# EAGLE design Esquematico (EAGLE 5.11)
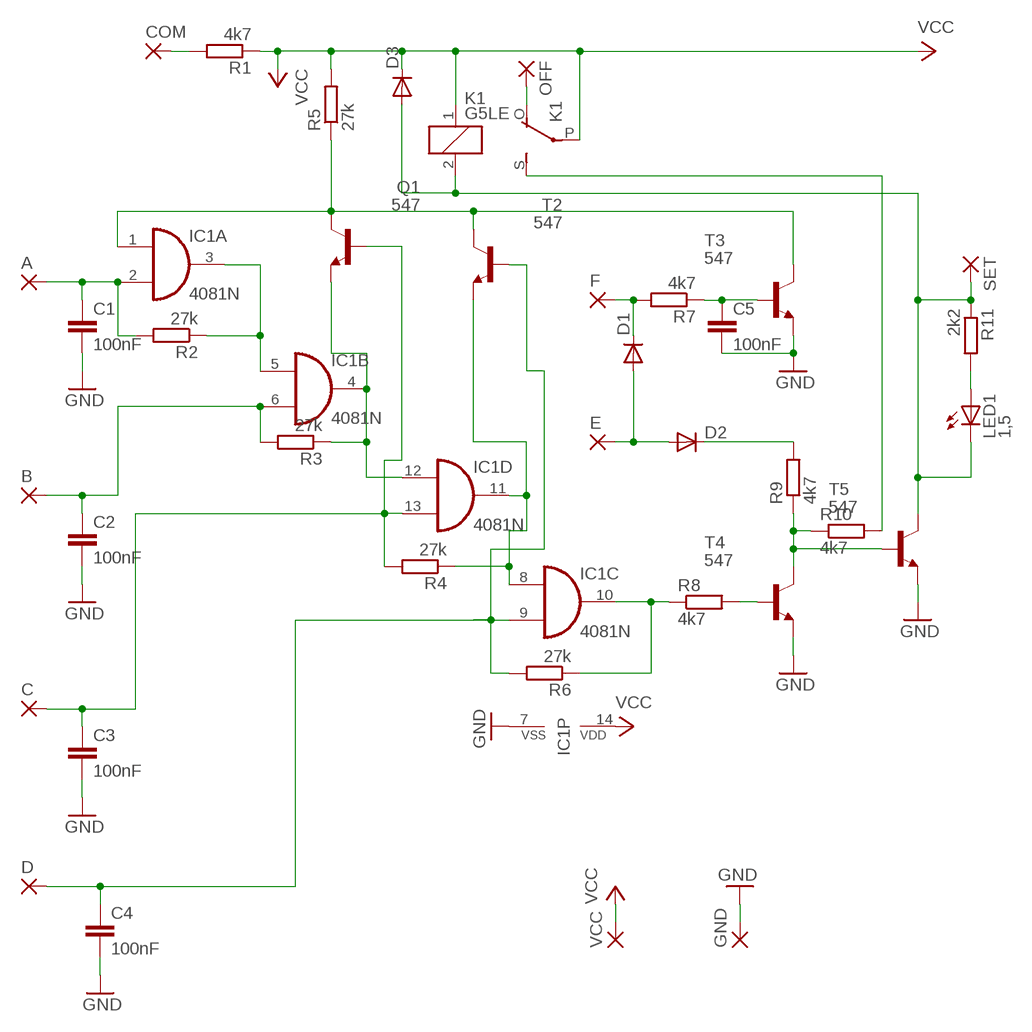
[diagram p0: schematic, sheet 1]

## Parts
A  WIREPAD2,15/1,0  [2,15/1,0]
B  WIREPAD2,15/1,0  [2,15/1,0]
C  WIREPAD2,15/1,0  [2,15/1,0]
C1  100nF  C2,5-3  [C2.5-3]
C2  100nF  C2,5-3  [C2.5-3]
C3  100nF  C2,5-3  [C2.5-3]
C4  100nF  C2,5-3  [C2.5-3]
C5  100nF  C2,5-3  [C2.5-3]
COM  WIREPAD2,15/1,0  [2,15/1,0]
D  WIREPAD2,15/1,0  [2,15/1,0]
D1  1N4148DO35-7  [DO35-7]
D2  1N4148DO35-7  [DO35-7]
D3  1N4148DO35-7  [DO35-7]
E  WIREPAD2,15/1,0  [2,15/1,0]
F  WIREPAD2,15/1,0  [2,15/1,0]
GND  WIREPAD2,15/1,0  [2,15/1,0]
IC1  4081N  [DIL14]
K1  G5LE  [G5LE]
LED1  1,5  LED5MM  [LED5MM]
OFF  WIREPAD2,15/1,0  [2,15/1,0]
Q1  547  BC547-NPN-TO92-CBE  [TO92-CBE]
R1  4k7  R-EU_0204/7  [0204/7]
R2  27k  R-EU_0204/7  [0204/7]
R3  27k  R-EU_0204/7  [0204/7]
R4  27k  R-EU_0204/7  [0204/7]
R5  27k  R-EU_0204/7  [0204/7]
R6  27k  R-EU_0204/7  [0204/7]
R7  4k7  R-EU_0204/7  [0204/7]
R8  4k7  R-EU_0204/7  [0204/7]
R9  4k7  R-EU_0204/7  [0204/7]
R10  4k7  R-EU_0204/7  [0204/7]
R11  2k2  R-EU_0204/7  [0204/7]
SET  WIREPAD2,15/1,0  [2,15/1,0]
T2  547  BC547-NPN-TO92-CBE  [TO92-CBE]
T3  547  BC547-NPN-TO92-CBE  [TO92-CBE]
T4  547  BC547-NPN-TO92-CBE  [TO92-CBE]
T5  547  BC547-NPN-TO92-CBE  [TO92-CBE]
VCC  WIREPAD2,15/1,0  [2,15/1,0]

## Nets
GND: C1.2 C2.2 C3.2 C4.2 C5.2 GND.1(P) IC1.7(P:VSS) T3.E T4.E T5.E
N$1: COM.1(P) R1.2
N$2: K1.O(2:O) OFF.1(P)
N$3: A.1(P) C1.1 IC1.2(A:I1) R2.2
N$4: IC1.1(A:I0) Q1.C R5.1 T2.C T3.C
N$5: D3.A K1.2 LED1.K(C) R11.1 SET.1(P) T5.C
N$6: IC1.3(A:O) IC1.5(B:I0) R2.1
N$7: IC1.4(B:O) IC1.12(D:I0) Q1.E R3.1
N$8: C3.1 C.1(P) IC1.13(D:I1) Q1.B R4.2
N$9: IC1.8(C:I0) IC1.11(D:O) R4.1 T2.E
N$10: B.1(P) C2.1 IC1.6(B:I1) R3.2
N$11: C4.1 D.1(P) IC1.9(C:I1) R6.2 T2.B
N$12: C5.1 R7.1 T3.B
N$13: D1.C F.1(P) R7.2
N$14: D1.A D2.A E.1(P)
N$15: D2.C R9.2
N$16: R9.1 R10.1 T4.C T5.B
N$17: R8.2 T4.B
N$18: IC1.10(C:O) R6.1 R8.1
N$19: K1.S(2:S) R10.2
N$22: LED1.A R11.2
VCC: D3.C IC1.14(P:VDD) K1.1 K1.P(2:P) R1.1 R5.2 VCC.1(P)

## Library data of the parts
A B C COM D E F GND OFF SET VCC = wirepad:WIREPAD: Wire PAD connect wire on PCB
C1-C5 = capacitor-wima:C: CAPACITOR naming: grid - package width
D1-D3 = diode:1N4148: DIODE high speed (Philips)
IC1 = 40xx:4081: Quad 2-input AND
K1 = relay:G5LE: RELAY 1 x switch, 10 A/120 V AC, 8 A/30 V DC, Omron; OC_FARNELL: unknown; OC_NEWARK: unknown
LED1 = led:LED: LED OSRAM: - CHIPLED LG R971, LG N971, LY N971, LG Q971, LY Q971, LO R971, LY R971 LH N974, LH R974 LS Q976, LO Q976, LY Q976 LO Q996 - Hyper CHIPLED LW Q18S LB Q993, LB Q99A, LB R99A - SideLED LS A670, LO A670, LY A670, LG A670, LP A670 LB A673, LV A673, LT A673, LW A673 LH A674 LY A675 LS A676, LA A676, LO A676, LY A676, LW A676 LS A679, LY A679, LG A679 - Hyper Micro SIDELED® LS Y876, LA Y876, LO Y876, LY Y876 LT Y87S - SmartLED LW L88C, LW L88S LB L89C, LB L89S, LG L890 LS L89K, LO L89K, LY L89K LS L896, LA L896, LO L896, LY L896 - TOPLED LS T670, LO T670, LY T670, LG T670, LP T670 LSG T670, LSP T670, LSY T670, LOP T670, LYG T670 LG T671, LOG T671, LSG T671 LB T673, LV T673, LT T673, LW T673 LH T674 LS T676, LA T676, LO T676, LY T676, LB T676, LH T676, LSB T676, LW T676 LB T67C, LV T67C, LT T67C, LS T67K, LO T67K, LY T67K, LW E67C LS E67B, LA E67B, LO E67B, LY E67B, LB E67C, LV E67C, LT E67C LW T67C LS T679, LY T679, LG T679 LS T770, LO T770, LY T770, LG T770, LP T770 LB T773, LV T773, LT T773, LW T773 LH T774 LS E675, LA E675, LY E675, LS T675 LS T776, LA T776, LO T776, LY T776, LB T776 LHGB T686 LT T68C, LB T68C - Hyper Mini TOPLED® LB M676 - Mini TOPLED Santana® LG M470 LS M47K, LO M47K, LY M47K Source: http://www.osram.convergy.de LUXEON: - LUMILED® LXK2-PW12-R00, LXK2-PW12-S00, LXK2-PW14-U00, LXK2-PW14-V00 LXK2-PM12-R00, LXK2-PM12-S00, LXK2-PM14-U00 LXK2-PE12-Q00, LXK2-PE12-R00, LXK2-PE12-S00, LXK2-PE14-T00, LXK2-PE14-U00 LXK2-PB12-K00, LXK2-PB12-L00, LXK2-PB12-M00, LXK2-PB14-N00, LXK2-PB14-P00, LXK2-PB14-Q00 LXK2-PR12-L00, LXK2-PR12-M00, LXK2-PR14-Q00, LXK2-PR14-R00 LXK2-PD12-Q00, LXK2-PD12-R00, LXK2-PD12-S00 LXK2-PH12-R00, LXK2-PH12-S00 LXK2-PL12-P00, LXK2-PL12-Q00, LXK2-PL12-R00 Source: www.luxeon.com KINGBRIGHT: KA-3528ASYC Source: www.kingbright.com
Q1 T2-T5 = transistor:*-NPN-: NPN Transistror BF959 corrected 2008.03.06
R1-R11 = rcl:R-EU_: RESISTOR, European symbol

## Board
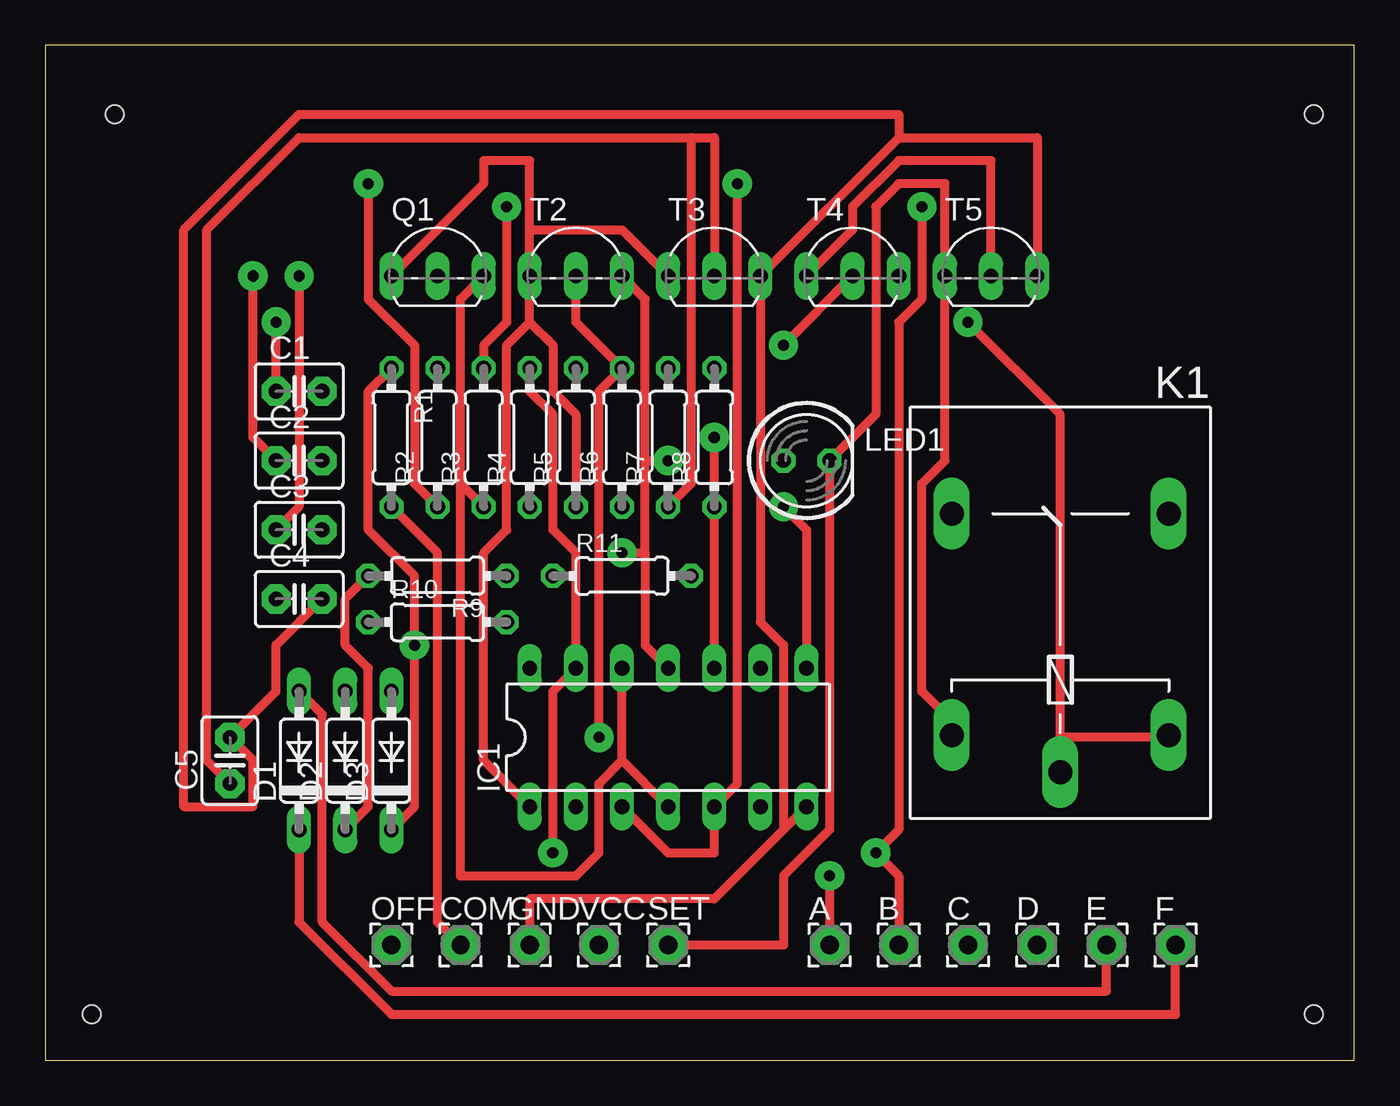
[diagram p1: board, top side]
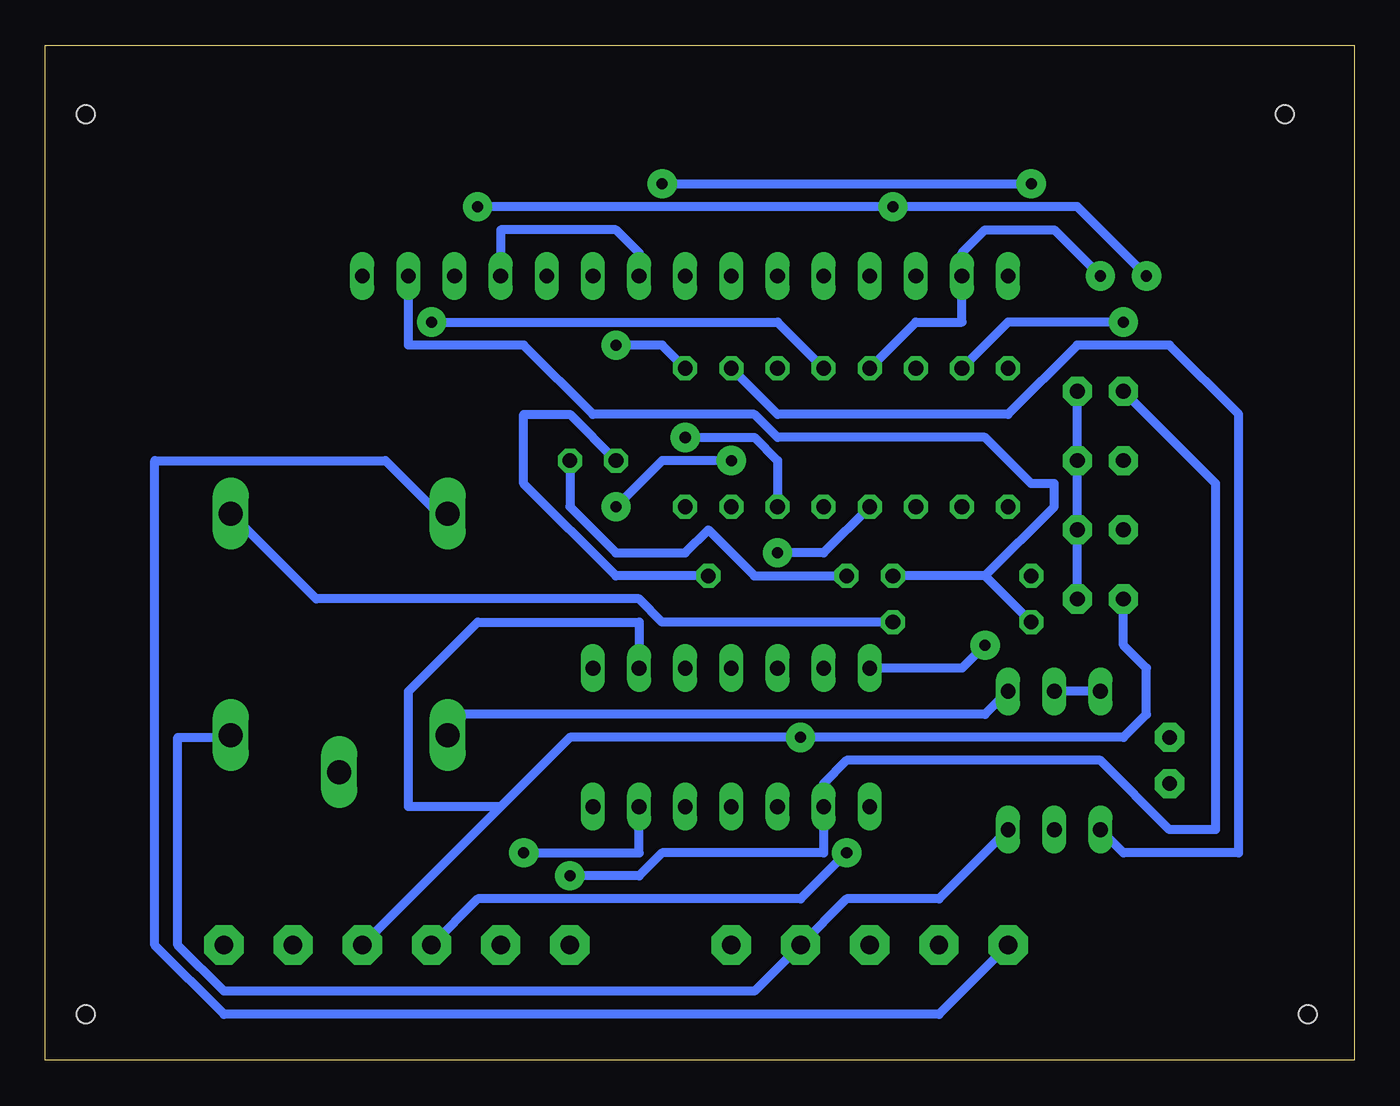
[diagram p2: board, bottom side, seen from below]

Size 72.06 x 55.87 mm. Coordinates in mm from the lower left corner, seen from the top.
Outline: 0,0 72.06,0 72.06,55.87 0,55.87 0,0
Copper layers (1*16): Top 0.035mm / dielectric 1.5mm / Bottom 0.035mm
Design rules "default *": minimum track width 20mil, minimum drill 24mil, track to track 8mil, track to pad 8mil, pad to pad 8mil, via to via 8mil, smd to smd 8mil, copper to edge 40mil, drill to drill 8mil, minimum pad ring 10mil, minimum via ring 0.5mm, stop-mask expansion 4mil, vias tented up to drill 0mil, thermal gap 10mil
Holes 1 mm at 3.81,52.07 2.54,2.54 69.85,52.07 69.85,2.54

### Footprints (pad centres in the part's own frame; a part is rotated, then mirrored left to right if it is on the bottom)
2,15/1,0 = drill 1.016 pad 2.159 octagon: 1 0,0
C2.5-3 = drill 0.813 pad 1.6 octagon: 1 -1.27,0; 2 1.27,0
DO35-7 = drill 0.813 long: A 3.81,0; C -3.81,0
DIL14 = drill 0.813 long: 1 -7.62,-3.81; 2 -5.08,-3.81; 3 -2.54,-3.81; 4 0,-3.81; 5 2.54,-3.81; 6 5.08,-3.81; 7 7.62,-3.81; 8 7.62,3.81; 9 5.08,3.81; 10 2.54,3.81; 11 0,3.81; 12 -2.54,3.81; 13 -5.08,3.81; 14 -7.62,3.81
G5LE = drill 1.321 long: 1 -7.493,-5.969; 2 -7.493,5.969; O 4.699,5.969; P -9.525,0; S 4.699,-5.969
LED5MM = drill 0.813 octagon: A -1.27,0; K 1.27,0
TO92-CBE = drill 0.813 long: B 0,0; C -2.54,0; E 2.54,0
0204/7 = drill 0.813 octagon: 1 -3.81,0; 2 3.81,0

### Placement (x,y rotation side)
A  43.18,6.35 0 top
B  46.99,6.35 0 top
C  50.8,6.35 0 top
C1  13.97,36.83 0 top
C2  13.97,33.02 0 top
C3  13.97,29.21 0 top
C4  13.97,25.4 0 top
C5  10.16,16.51 90 top
COM  22.86,6.35 0 top
D  54.61,6.35 0 top
D1  13.97,16.51 90 top
D2  16.51,16.51 90 top
D3  19.05,16.51 90 top
E  58.42,6.35 0 top
F  62.23,6.35 0 top
GND  26.67,6.35 0 top
IC1  34.29,17.78 0 top
K1  55.88,25.4 90 top
LED1  41.91,33.02 0 top
OFF  19.05,6.35 0 top
Q1  21.59,43.18 0 top
R1  19.05,34.29 270 top
R2  21.59,34.29 90 top
R3  24.13,34.29 90 top
R4  26.67,34.29 90 top
R5  29.21,34.29 90 top
R6  31.75,34.29 90 top
R7  34.29,34.29 90 top
R8  36.83,34.29 90 top
R9  21.59,26.67 180 top
R10  21.59,24.13 0 top
R11  31.75,26.67 0 top
SET  34.29,6.35 0 top
T2  29.21,43.18 0 top
T3  36.83,43.18 0 top
T4  44.45,43.18 0 top
T5  52.07,43.18 0 top
VCC  30.48,6.35 0 top

### Tracks (layer width: path | path; a pad name or v marks a point on that pad's centre or on a via)
GND
  Top 0.508: C4.2 12.7,22.86 12.7,20.32 C5.2 11.43,16.51 11.43,13.97 7.62,13.97 7.62,45.72 13.97,52.07 46.99,52.07 46.99,50.8 | 46.99,50.8 T3.E 39.37,24.13 40.64,22.86 40.64,12.7 | 46.99,50.8 54.61,50.8 T5.E | 40.64,12.7 36.83,8.89 26.67,8.89 GND.1 | 40.64,12.7 IC1.7
  Bottom 0.508: C1.2 C2.2 C3.2 C4.2 | T4.E 46.99,45.72 40.64,45.72 39.37,44.45 T3.E
N$1
  Top 0.508: R1.2 21.59,27.94 21.59,7.62 COM.1
N$2
  Bottom 0.508: OFF.1 22.86,2.54 62.23,2.54 66.04,6.35 66.04,33.02 53.34,33.02 50.8,30.48 K1.O
N$3  (via drill 0.61)
  Top 0.508: C1.1 v12.7,40.64 | v43.18,10.16 A.1
  Bottom 0.508: v12.7,40.64 19.05,40.64 R2.2 | v43.18,10.16 39.37,10.16 38.1,11.43 29.21,11.43 IC1.2 29.21,15.24 27.94,16.51 13.97,16.51 10.16,12.7 7.62,12.7 7.62,31.75 C1.1
N$4
  Top 0.508: IC1.1 24.13,16.51 24.13,27.94 25.4,29.21 25.4,39.37 26.67,40.64 | 26.67,40.64 T2.C 26.67,45.72 | R5.1 29.21,35.56 27.94,36.83 27.94,39.37 26.67,40.64 | Q1.C 24.13,48.26 24.13,49.53 26.67,49.53 26.67,45.72 | T3.C 31.75,45.72 26.67,45.72
N$5
  Top 0.508: SET.1 40.64,6.35 40.64,10.16 43.18,12.7 LED1.K 45.72,35.56 45.72,46.99 46.99,48.26 49.53,48.26 T5.C 49.53,33.02 48.26,31.75 48.26,20.32 49.53,19.05 K1.2
  Bottom 0.508: R11.1 33.02,26.67 35.56,29.21 36.83,27.94 40.64,27.94 43.18,30.48 LED1.K | D3.A 20.32,19.05 49.53,19.05 K1.2
N$6  (via drill 0.61)
  Top 0.508: IC1.3 34.29,11.43 36.83,11.43 IC1.5 38.1,15.24 v38.1,48.26 | R2.1 20.32,31.75 20.32,39.37 17.78,41.91 v17.78,48.26
  Bottom 0.508: v38.1,48.26 v17.78,48.26
N$7
  Top 0.508: 31.75,16.51 IC1.4 | 31.75,16.51 IC1.12 | 22.86,31.75 R3.1 | 22.86,31.75 22.86,41.91 Q1.E | 31.75,16.51 30.48,15.24 30.48,11.43 29.21,10.16 22.86,10.16 22.86,31.75
N$8  (via drill 0.61)
  Top 0.508: C3.1 13.97,30.48 v13.97,43.18 | R4.2 26.67,36.83 27.94,35.56 27.94,29.21 29.21,27.94 IC1.13 27.94,20.32 v27.94,11.43
  Bottom 0.508: v13.97,43.18 16.51,45.72 20.32,45.72 21.59,44.45 Q1.B 21.59,40.64 24.13,40.64 R4.2 | C.1 48.26,8.89 30.48,8.89 v27.94,11.43
N$9  (via drill 0.61)
  Top 0.508: IC1.11 33.02,22.86 33.02,27.94 | 33.02,33.02 33.02,41.91 T2.E | 33.02,27.94 33.02,33.02 | IC1.8 41.91,29.21 v40.64,30.48 | 33.02,33.02 v34.29,33.02 | v31.75,27.94 33.02,27.94
  Bottom 0.508: v40.64,30.48 38.1,33.02 v34.29,33.02 | R4.1 29.21,27.94 v31.75,27.94
N$10  (via drill 0.61)
  Top 0.508: B.1 46.99,10.16 v45.72,11.43 46.99,12.7 46.99,40.64 48.26,41.91 v48.26,46.99 | C2.1 11.43,34.29 v11.43,43.18 | v25.4,46.99 25.4,40.64 24.13,39.37 R3.2
  Bottom 0.508: IC1.6 39.37,11.43 v45.72,11.43 | v11.43,43.18 15.24,46.99 v25.4,46.99 v48.26,46.99
N$11  (via drill 0.61)
  Top 0.508: T2.B 29.21,40.64 R6.2 30.48,36.83 v30.48,17.78
  Bottom 0.508: C4.1 12.7,22.86 11.43,21.59 11.43,19.05 12.7,17.78 v30.48,17.78 43.18,17.78 46.99,13.97 | 46.99,13.97 D.1 | IC1.9 39.37,24.13 48.26,24.13 52.07,20.32 52.07,13.97 46.99,13.97
N$12
  Top 0.508: C5.1 8.89,16.51 8.89,45.72 13.97,50.8 35.56,50.8 | 35.56,50.8 36.83,50.8 T3.B | R7.1 35.56,31.75 35.56,50.8
N$13
  Top 0.508: D1.C 13.97,7.62 19.05,2.54 62.23,2.54 F.1
  Bottom 0.508: R7.2 31.75,35.56 19.05,35.56 15.24,39.37 10.16,39.37 6.35,35.56 6.35,11.43 12.7,11.43 D1.C
N$14
  Top 0.508: D1.A 15.24,19.05 15.24,7.62 19.05,3.81 58.42,3.81 E.1
  Bottom 0.508: D1.A D2.A
N$15
  Top 0.508: D2.C 17.78,13.97 17.78,21.59 16.51,22.86 16.51,25.4 R9.2
N$16
  Top 0.508: T4.C 44.45,45.72 44.45,46.99 46.99,49.53 52.07,49.53 T5.B
  Bottom 0.508: R10.1 20.32,26.67 | 20.32,26.67 R9.1 | 20.32,26.67 16.51,30.48 16.51,31.75 17.78,31.75 20.32,34.29 31.75,34.29 33.02,35.56 41.91,35.56 45.72,39.37 52.07,39.37 T5.B
N$17  (via drill 0.61)
  Top 0.508: v40.64,39.37 T4.B
  Bottom 0.508: R8.2 38.1,39.37 v40.64,39.37
N$18  (via drill 0.61)
  Top 0.508: v36.83,34.29 R8.1 IC1.10
  Bottom 0.508: R6.1 31.75,33.02 33.02,34.29 v36.83,34.29
N$19
  Bottom 0.508: R10.2 38.1,24.13 39.37,25.4 57.15,25.4 60.96,29.21 K1.S
N$22
  Bottom 0.508: R11.2 40.64,26.67 45.72,31.75 45.72,35.56 43.18,35.56 LED1.A
VCC  (via drill 0.61)
  Top 0.508: R1.1 17.78,36.83 17.78,29.21 20.32,26.67 v20.32,22.86 20.32,13.97 D3.C | v50.8,40.64 55.88,35.56 55.88,17.78 | 55.88,17.78 55.88,16.51 K1.P 55.88,17.78 | 55.88,17.78 60.96,17.78 K1.1
  Bottom 0.508: D3.C 22.86,8.89 27.94,8.89 VCC.1 33.02,3.81 62.23,3.81 64.77,6.35 64.77,17.78 62.23,17.78 K1.1 | IC1.14 21.59,21.59 v20.32,22.86 | R5.2 31.75,40.64 v50.8,40.64